# Altium schematic sheet Sheet1.SchDoc
size A3; SheetNumber: 1; SheetTotal: 1
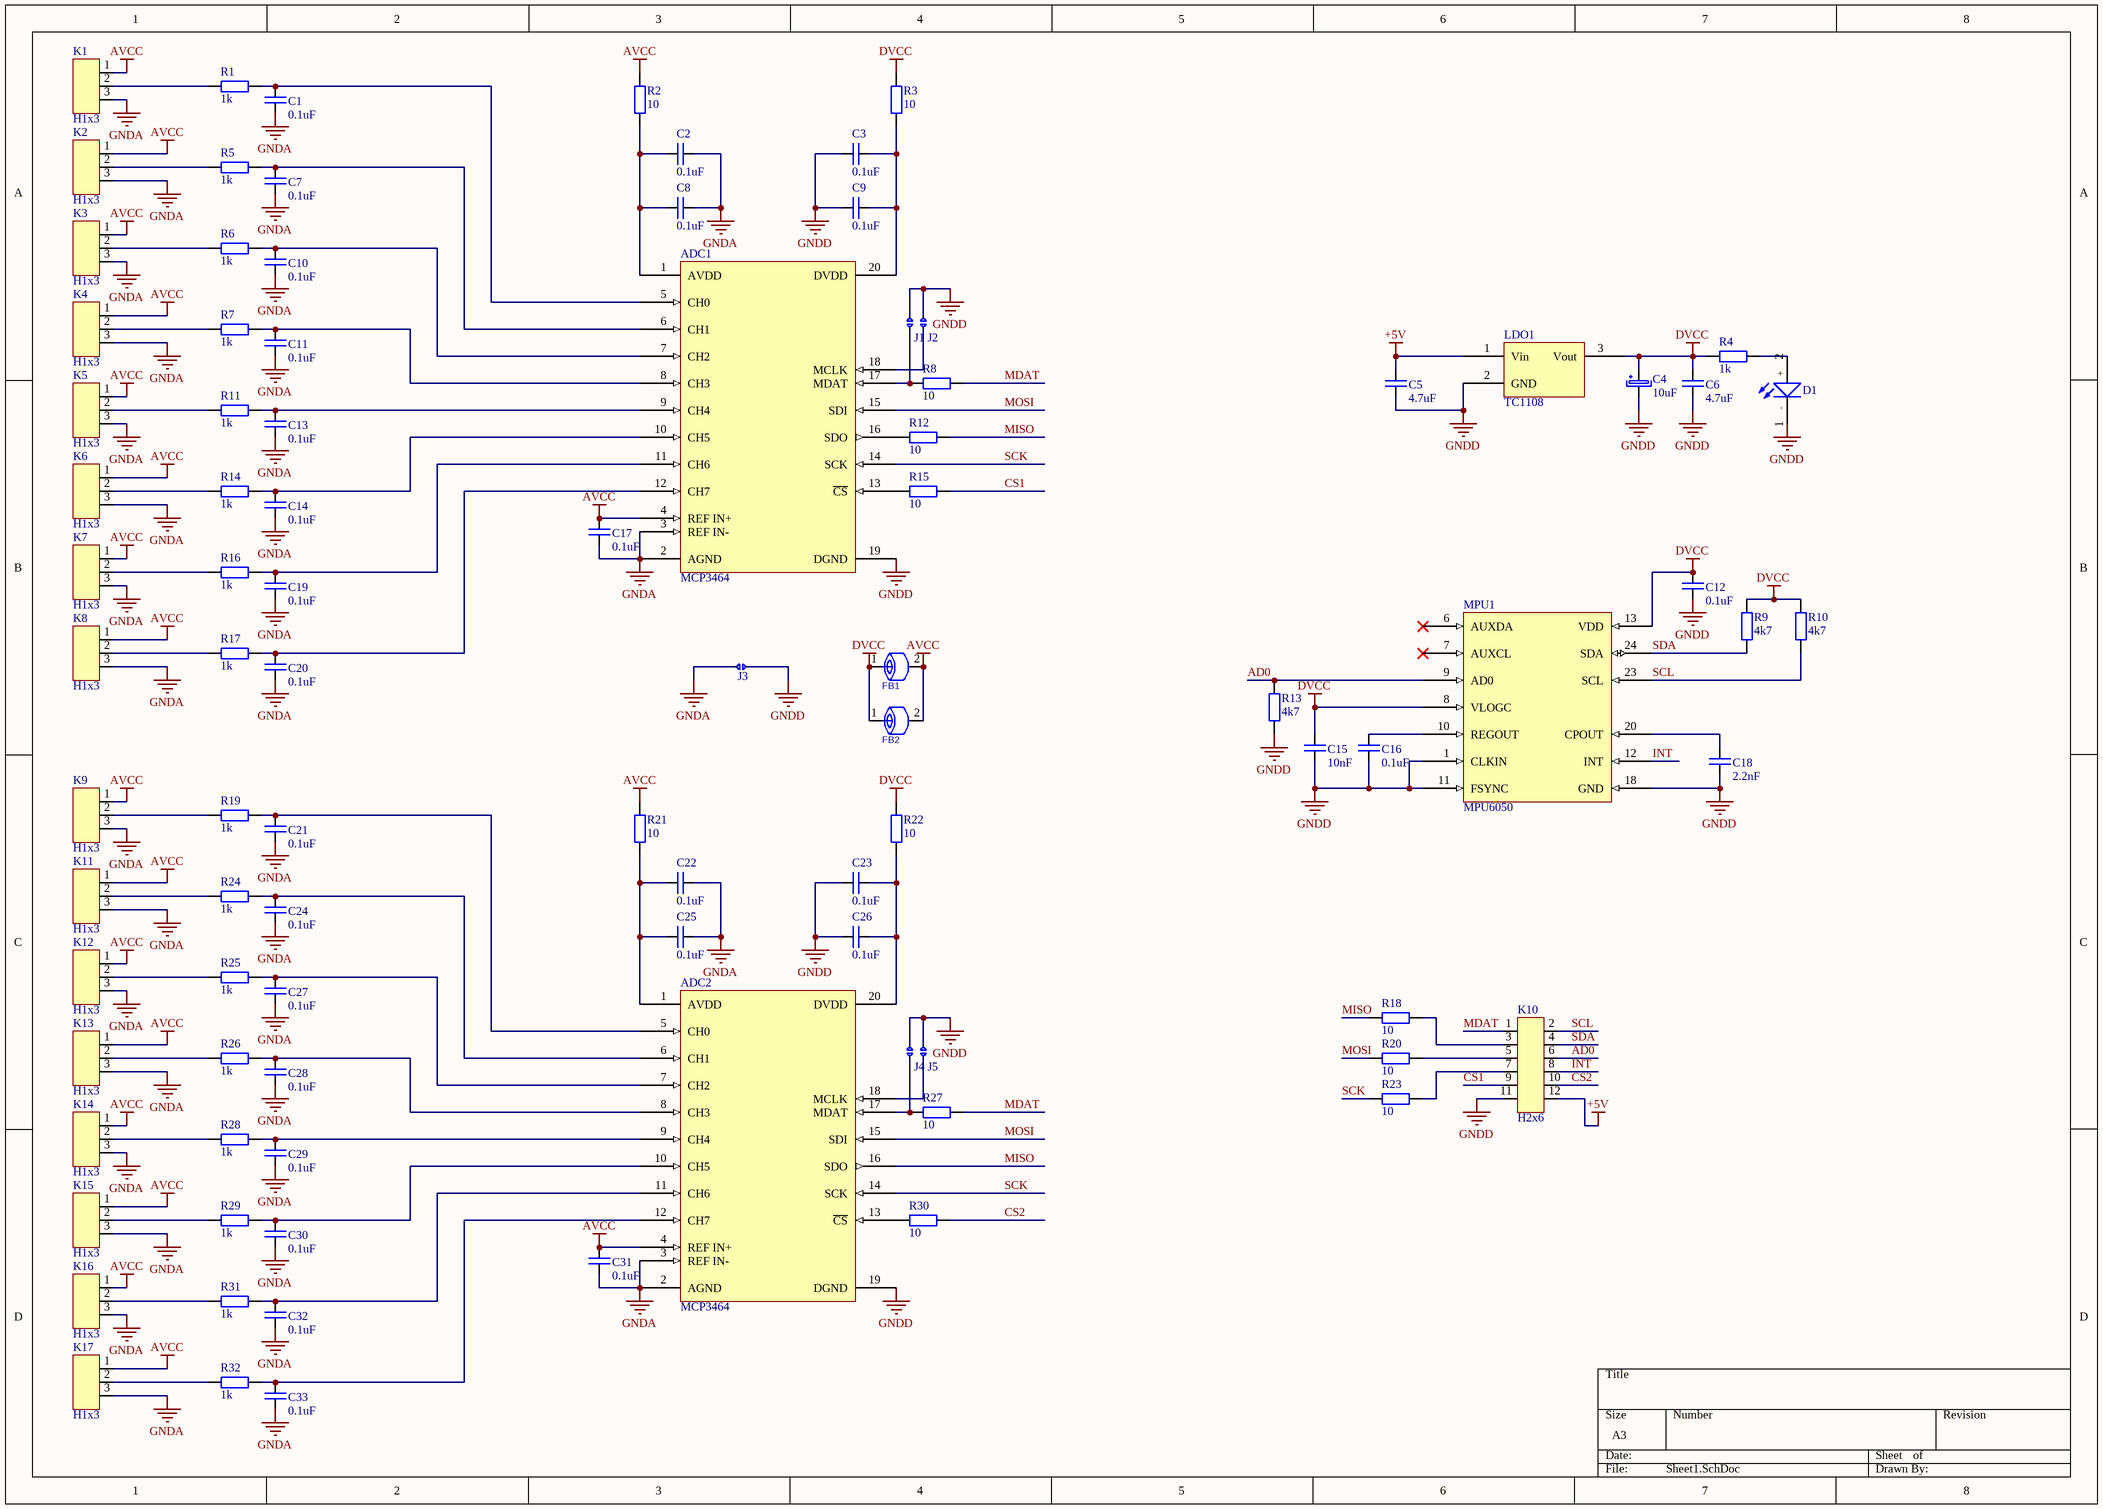
[diagram p0: Sheet1.SchDoc]

## Parts
ADC1  MCP3464  [TSOP65P640X120-20N ADC]
ADC2  MCP3464  [TSOP65P640X120-20N ADC]
C1  0.1uF  [C1608_0603I_M]
C2  0.1uF  [C1608_0603I_M]
C3  0.1uF  [C1608_0603I_M]
C4  10uF  [C Tantal A]
C5  4.7uF  [C1608_0603I_M]
C6  4.7uF  [C1608_0603I_M]
C7  0.1uF  [C1608_0603I_M]
C8  0.1uF  [C1608_0603I_M]
C9  0.1uF  [C1608_0603I_M]
C10  0.1uF  [C1608_0603I_M]
C11  0.1uF  [C1608_0603I_M]
C12  0.1uF  [C1608_0603I_M]
C13  0.1uF  [C1608_0603I_M]
C14  0.1uF  [C1608_0603I_M]
C15  10nF  [C1608_0603I_M]
C16  0.1uF  [C1608_0603I_M]
C17  0.1uF  [C1608_0603I_M]
C18  2.2nF  [C1608_0603I_M]
C19  0.1uF  [C1608_0603I_M]
C20  0.1uF  [C1608_0603I_M]
C21  0.1uF  [C1608_0603I_M]
C22  0.1uF  [C1608_0603I_M]
C23  0.1uF  [C1608_0603I_M]
C24  0.1uF  [C1608_0603I_M]
C25  0.1uF  [C1608_0603I_M]
C26  0.1uF  [C1608_0603I_M]
C27  0.1uF  [C1608_0603I_M]
C28  0.1uF  [C1608_0603I_M]
C29  0.1uF  [C1608_0603I_M]
C30  0.1uF  [C1608_0603I_M]
C31  0.1uF  [C1608_0603I_M]
C32  0.1uF  [C1608_0603I_M]
C33  0.1uF  [C1608_0603I_M]
D1  LED  [LED1608_0603I_M]  (value not drawn)
FB1  FERITTE BEAD  [R1608_0603I_M]  (value not drawn)
FB2  FERITTE BEAD  [R1608_0603I_M]  (value not drawn)
J1  JMP_mini  [solderJumper]  (value not drawn)
J2  JMP_mini  [solderJumper]  (value not drawn)
J3  JMP_mini  [solderJumper]  (value not drawn)
J4  JMP_mini  [solderJumper]  (value not drawn)
J5  JMP_mini  [solderJumper]  (value not drawn)
K1  H1x3  [H1x3]
K2  H1x3  [H1x3]
K3  H1x3  [H1x3]
K4  H1x3  [H1x3]
K5  H1x3  [H1x3]
K6  H1x3  [H1x3]
K7  H1x3  [H1x3]
K8  H1x3  [H1x3]
K9  H1x3  [H1x3]
K10  H2x6  [H2x6]
K11  H1x3  [H1x3]
K12  H1x3  [H1x3]
K13  H1x3  [H1x3]
K14  H1x3  [H1x3]
K15  H1x3  [H1x3]
K16  H1x3  [H1x3]
K17  H1x3  [H1x3]
LDO1  TC1108  [SOT230P700X180-4N 3V3 LDO]
MPU1  MPU6050  [QFN50P400X400X95_HS-25N]
R1  1k  [R1608_0603I_M]
R2  10  [R1608_0603I_M]
R3  10  [R1608_0603I_M]
R4  1k  [R1608_0603I_M]
R5  1k  [R1608_0603I_M]
R6  1k  [R1608_0603I_M]
R7  1k  [R1608_0603I_M]
R8  10  [R1608_0603I_M]
R9  4k7  [R1608_0603I_M]
R10  4k7  [R1608_0603I_M]
R11  1k  [R1608_0603I_M]
R12  10  [R1608_0603I_M]
R13  4k7  [R1608_0603I_M]
R14  1k  [R1608_0603I_M]
R15  10  [R1608_0603I_M]
R16  1k  [R1608_0603I_M]
R17  1k  [R1608_0603I_M]
R18  10  [R1608_0603I_M]
R19  1k  [R1608_0603I_M]
R20  10  [R1608_0603I_M]
R21  10  [R1608_0603I_M]
R22  10  [R1608_0603I_M]
R23  10  [R1608_0603I_M]
R24  1k  [R1608_0603I_M]
R25  1k  [R1608_0603I_M]
R26  1k  [R1608_0603I_M]
R27  10  [R1608_0603I_M]
R28  1k  [R1608_0603I_M]
R29  1k  [R1608_0603I_M]
R30  10  [R1608_0603I_M]
R31  1k  [R1608_0603I_M]
R32  1k  [R1608_0603I_M]

## Nets
+5V: C5.1 K10.12 LDO1.1(Vin)
AVCC: ADC1.4(REF_IN+) ADC2.4(REF_IN+) C17.2 C31.2 FB1.2 FB2.2 K1.1 K2.1 K3.1 K4.1 K5.1 K6.1 K7.1 K8.1 K9.1 K11.1 K12.1 K13.1 K14.1 K15.1 K16.1 K17.1 R2.1 R21.1
DVCC: C4.1 C6.1 C12.2 C15.1 FB1.1 FB2.1 LDO1.3(Vout) MPU1.8(VLOGC) MPU1.13(VDD) R3.1 R4.1 R9.2 R10.1 R22.1
GNDA: ADC1.2(AGND) ADC1.3(REF_IN-) ADC2.2(AGND) ADC2.3(REF_IN-) C1.1 C2.2 C7.1 C8.2 C10.1 C11.1 C13.1 C14.1 C17.1 C19.1 C20.1 C21.1 C22.2 C24.1 C25.2 C27.1 C28.1 C29.1 C30.1 C31.1 C32.1 C33.1 J3.2 K1.3 K2.3 K3.3 K4.3 K5.3 K6.3 K7.3 K8.3 K9.3 K11.3 K12.3 K13.3 K14.3 K15.3 K16.3 K17.3
GNDD: ADC1.19(DGND) ADC2.19(DGND) C3.1 C4.2 C5.2 C6.2 C9.1 C12.1 C15.2 C16.1 C18.2 C23.1 C26.1 D1.1(-) J1.2 J2.2 J3.1 J4.2 J5.2 K10.11 LDO1.2(GND) MPU1.1(CLKIN) MPU1.11(FSYNC) MPU1.18(GND) R13.2
AD0: K10.6 MPU1.9(AD0) R13.1
CS1: K10.9 R15.2
CS2: K10.10 R30.2
INT: K10.8 MPU1.12(INT)
MDAT: K10.1 R8.2 R27.2
MISO: ADC2.16(SDO) R12.2 R18.1
MOSI: ADC1.15(SDI) ADC2.15(SDI) R20.1
SCK: ADC1.14(SCK) ADC2.14(SCK) R23.1
SCL: K10.2 MPU1.23(SCL) R10.2
SDA: K10.4 MPU1.24(SDA) R9.1
NetADC1_1: ADC1.1(AVDD) C2.1 C8.1 R2.2
NetADC1_5: ADC1.5(CH0) C1.2 R1.2
NetADC1_6: ADC1.6(CH1) C7.2 R5.2
NetADC1_7: ADC1.7(CH2) C10.2 R6.2
NetADC1_8: ADC1.8(CH3) C11.2 R7.2
NetADC1_9: ADC1.9(CH4) C13.2 R11.2
NetADC1_10: ADC1.10(CH5) C14.2 R14.2
NetADC1_11: ADC1.11(CH6) C19.2 R16.2
NetADC1_12: ADC1.12(CH7) C20.2 R17.2
NetADC1_13: ADC1.13(~{CS}) R15.1
NetADC1_16: ADC1.16(SDO) R12.1
NetADC1_17: ADC1.17(MDAT) J1.1 R8.1
NetADC1_18: ADC1.18(MCLK) J2.1
NetADC1_20: ADC1.20(DVDD) C3.2 C9.2 R3.2
NetADC2_1: ADC2.1(AVDD) C22.1 C25.1 R21.2
NetADC2_5: ADC2.5(CH0) C21.2 R19.2
NetADC2_6: ADC2.6(CH1) C24.2 R24.2
NetADC2_7: ADC2.7(CH2) C27.2 R25.2
NetADC2_8: ADC2.8(CH3) C28.2 R26.2
NetADC2_9: ADC2.9(CH4) C29.2 R28.2
NetADC2_10: ADC2.10(CH5) C30.2 R29.2
NetADC2_11: ADC2.11(CH6) C32.2 R31.2
NetADC2_12: ADC2.12(CH7) C33.2 R32.2
NetADC2_13: ADC2.13(~{CS}) R30.1
NetADC2_17: ADC2.17(MDAT) J4.1 R27.1
NetADC2_18: ADC2.18(MCLK) J5.1
NetADC2_20: ADC2.20(DVDD) C23.2 C26.2 R22.2
NetC16_2: C16.2 MPU1.10(REGOUT)
NetC18_1: C18.1 MPU1.20(CPOUT)
NetD1_2: D1.2(+) R4.2
NetK1_2: K1.2 R1.1
NetK2_2: K2.2 R5.1
NetK3_2: K3.2 R6.1
NetK4_2: K4.2 R7.1
NetK5_2: K5.2 R11.1
NetK6_2: K6.2 R14.1
NetK7_2: K7.2 R16.1
NetK8_2: K8.2 R17.1
NetK9_2: K9.2 R19.1
NetK10_3: K10.3 R18.2
NetK10_5: K10.5 R20.2
NetK10_7: K10.7 R23.2
NetK11_2: K11.2 R24.1
NetK12_2: K12.2 R25.1
NetK13_2: K13.2 R26.1
NetK14_2: K14.2 R28.1
NetK15_2: K15.2 R29.1
NetK16_2: K16.2 R31.1
NetK17_2: K17.2 R32.1

Not connected (* = marked no-connect by the designer): MPU1 6(AUXDA)* 7(AUXCL)*

## Library data of the parts
C1-C3 C5-C33 = C: Capacitor
C4 = C+: Capacitor Polarized
K1-K9 K11-K17 = H1x3: Header 1x3 (male)
K10 = H2x6: Header 2x5 (male)
R1-R32 = R